# EAGLE schematic board (EAGLE 6.4)
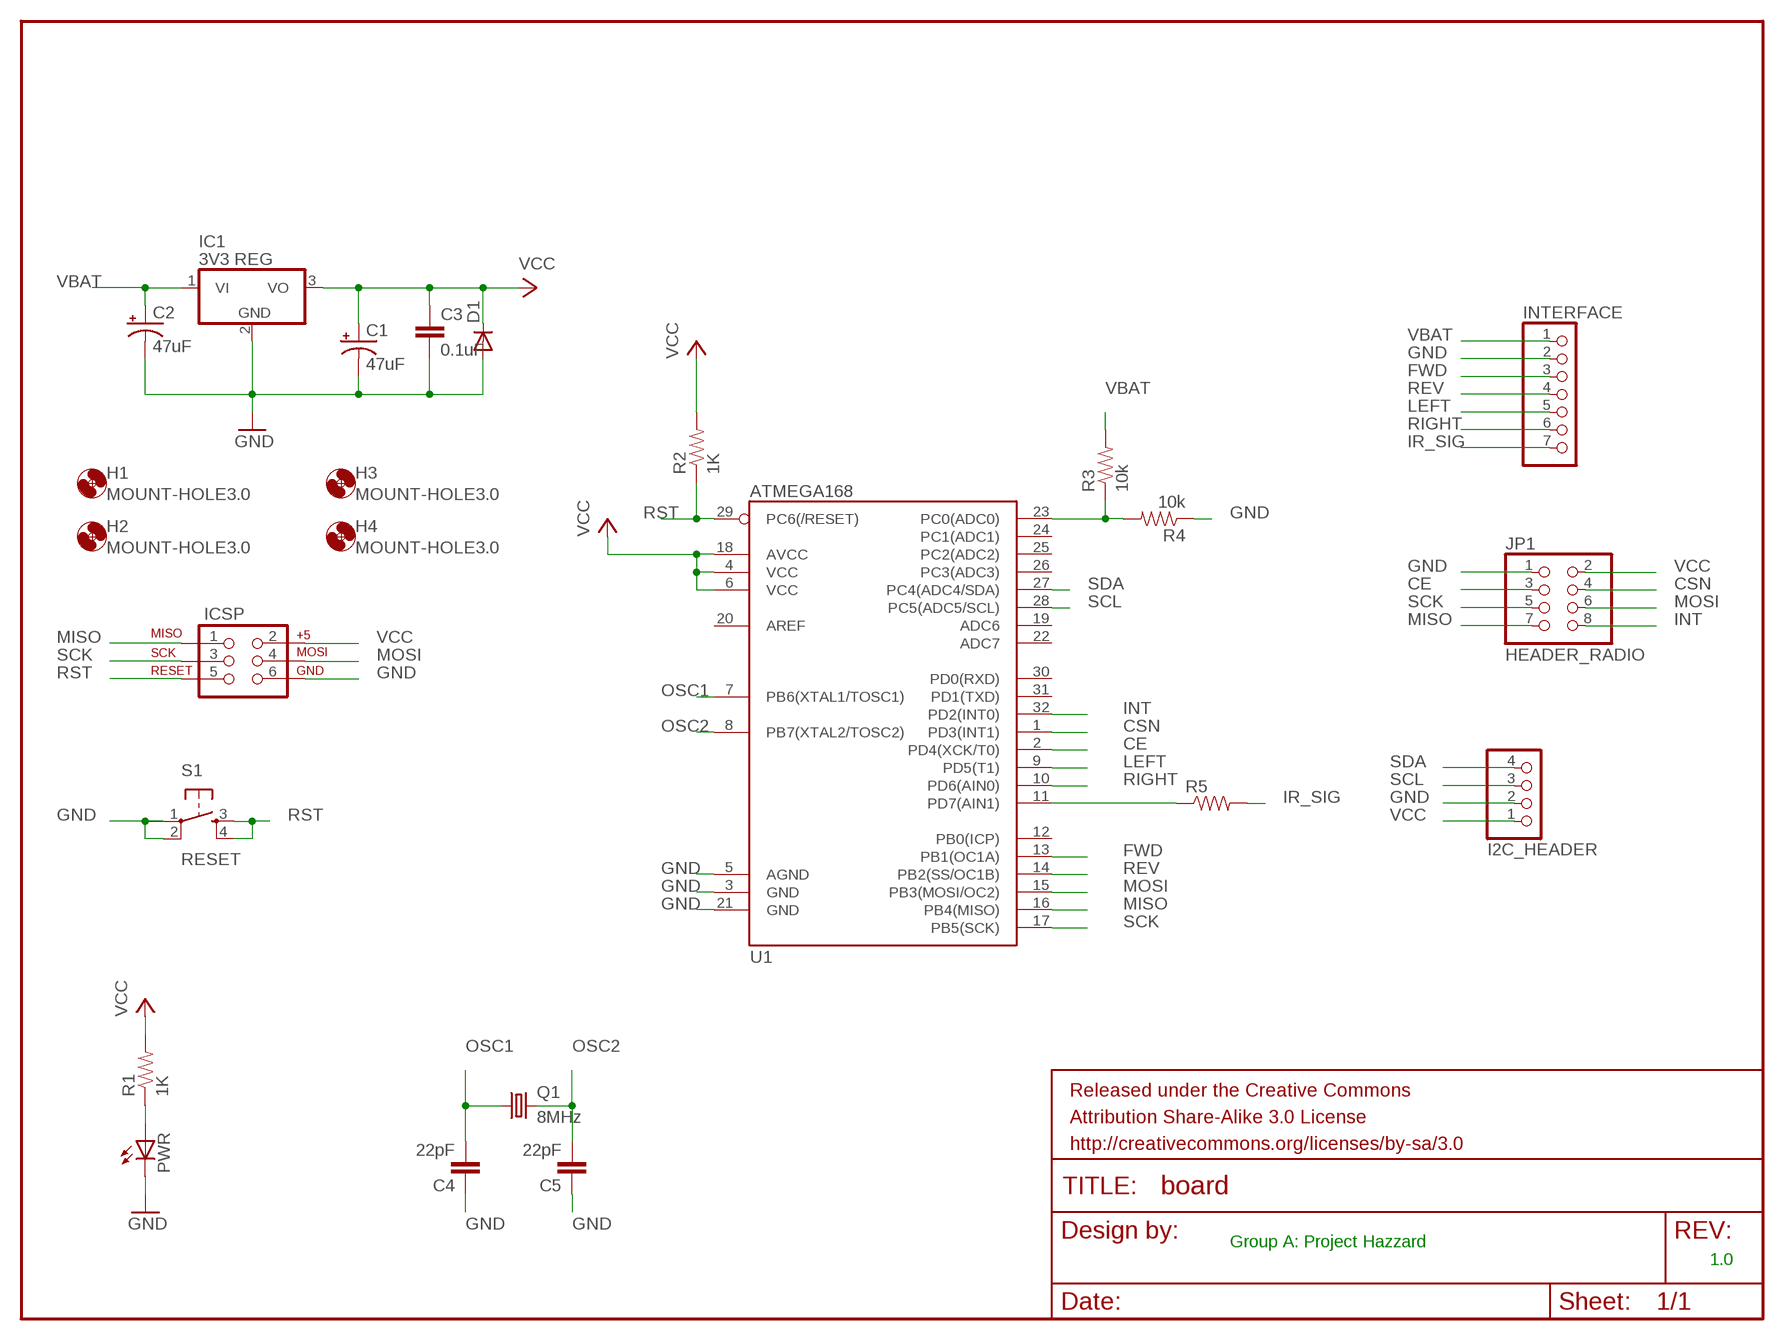
[diagram p0: schematic, sheet 1]

## Parts
C1  47uF  CAP_POLPTH1  [CPOL-RADIAL-100UF-25V]
C2  47uF  CAP_POLPTH1  [CPOL-RADIAL-100UF-25V]
C3  0.1uF  CAPKIT  [CAP-PTH-SMALL-KIT]
C4  22pF  CAPPTH  [CAP-PTH-SMALL]
C5  22pF  CAPPTH  [CAP-PTH-SMALL]
D1  DIODEPTH  [DIODE-1N4001]
FRAME1  FRAME-LETTER  [CREATIVE_COMMONS]
H1  MOUNT-HOLE3.0  [3,0]
H2  MOUNT-HOLE3.0  [3,0]
H3  MOUNT-HOLE3.0  [3,0]
H4  MOUNT-HOLE3.0  [3,0]
I2C_HEADER  PINHD-1X4  [1X04]
IC1  3V3 REG  786TV  [TO220V]
ICSP  AVR_SPI_PRG_6PTH  [2X3]
INTERFACE  PINHD-1X7  [1X07]
JP1  HEADER_RADIO  PINHD-2X4  [2X04]
PWR  LED5MM  [LED5MM]
Q1  8MHz  CRYSTALHC49S  [HC49/S]
R1  1K  RESISTORPTH-1/4W  [AXIAL-0.4]
R2  1K  RESISTORPTH-1/4W  [AXIAL-0.4]
R3  10k  RESISTORPTH-1/4W  [AXIAL-0.4]
R4  10k  RESISTORPTH-1/4W  [AXIAL-0.4]
R5  RESISTORPTH-1/4W  [AXIAL-0.4]
S1  RESET  TAC_SWITCHPTH  [TACTILE-PTH]
U1  ATMEGA168  [TQFP32-08]

## Nets
CE: JP1.3 U1.2(PD4(XCK/T0))
CSN: JP1.4 U1.1(PD3(INT1))
FWD: INTERFACE.3 U1.13(PB1(OC1A))
GND: C1.2(-) C2.2(-) C3.2 C4.1 C5.1 D1.A I2C_HEADER.2 IC1.2(GND) ICSP.6 INTERFACE.2 JP1.1 PWR.K(C) R4.P$1 S1.1 S1.2 U1.3(GND) U1.5(AGND) U1.21(GND)
INT: JP1.8 U1.32(PD2(INT0))
IR_SIG: INTERFACE.7 R5.P$2
LEFT: INTERFACE.5 U1.9(PD5(T1))
MISO: ICSP.1 JP1.7 U1.16(PB4(MISO))
MOSI: ICSP.4 JP1.6 U1.15(PB3(MOSI/OC2))
N$1: PWR.A R1.P$1
N$2: R3.P$1 R4.P$2 U1.23(PC0(ADC0))
N$3: R5.P$1 U1.11(PD7(AIN1))
OSC1: C4.2 Q1.1 U1.7(PB6(XTAL1/TOSC1))
OSC2: C5.2 Q1.2 U1.8(PB7(XTAL2/TOSC2))
REV: INTERFACE.4 U1.14(PB2(SS/OC1B))
RIGHT: INTERFACE.6 U1.10(PD6(AIN0))
RST: ICSP.5 R2.P$1 S1.3 S1.4 U1.29(PC6(/RESET))
SCK: ICSP.3 JP1.5 U1.17(PB5(SCK))
SCL: I2C_HEADER.3 U1.28(PC5(ADC5/SCL))
SDA: I2C_HEADER.4 U1.27(PC4(ADC4/SDA))
VBAT: C2.1(+) IC1.1(VI) INTERFACE.1 R3.P$2
VCC [power]: C1.1(+) C3.1 D1.C I2C_HEADER.1 IC1.3(VO) ICSP.2 JP1.2 R1.P$2 R2.P$2 U1.4(VCC) U1.6(VCC) U1.18(AVCC)
Unconnected: U1.12(PB0(ICP)) U1.19(ADC6) U1.20(AREF) U1.22(ADC7) U1.24(PC1(ADC1)) U1.25(PC2(ADC2)) U1.26(PC3(ADC3)) U1.30(PD0(RXD)) U1.31(PD1(TXD))

## Notes on the sheet
- Group A: Project Hazzard
- 1.0

## Library data of the parts
C1 C2 = SparkFun:CAP_POL: Capacitor Polarized These are standard SMD and PTH capacitors. Normally 10uF, 47uF, and 100uF in electrolytic and tantalum varieties. Always verify the external diameter of the through hole cap, it varies with capacity, voltage, and manufacturer. The EIA devices should be standard.
C3-C5 = SparkFun:CAP: Capacitor Standard 0603 ceramic capacitor, and 0.1" leaded capacitor.
D1 = SparkFun:DIODE: Diode These are standard reverse protection diodes and small signal diodes. SMA package can handle up to about 1A. SOD-323 can handle about 200mA. What the SOD-323 package when ordering, there are some mfgs out there that are 5-pin packages.
FRAME1 = SparkFun-Aesthetics:FRAME-LETTER: Schematic Frame Standard 8.5x11 US Letter frame
H1-H4 = holes:MOUNT-HOLE: MOUNTING HOLE with drill center marker
I2C_HEADER = pinhead:PINHD-1X4: PIN HEADER
IC1 = linear:78*: Positive VOLTAGE REGULATOR Source: http://cache.national.com/ds/LM/LM78L05.pdf http://www.fairchildsemi.com/ds/LM/LM7805.pdf
ICSP = SparkFun-Connectors:AVR_SPI_PRG_6: AVR ISP 6 Pin This is the reduced ISP connector for AVR programming. Common on Arduino. This footprint will take up less PCB space and can be used with a 10-pin to 6-pin adapter such as SKU: BOB-08508
INTERFACE = pinhead:PINHD-1X7: PIN HEADER
JP1 = pinhead:PINHD-2X4: PIN HEADER
PWR = SparkFun:LED: LEDs Standard schematic elements and footprints for 5mm, 3mm, 1206, and 0603 sized LEDs. 5mm - Spark Fun Electronics SKU : COM-00529 (and others)
Q1 = crystal:CRYSTAL: CRYSTAL; OC_FARNELL: 1667008; OC_NEWARK: unknown
R1 R2 = SparkFun:RESISTOR: Resistor Basic schematic elements and footprints for 0603, 1206, and PTH resistors.
R3-R5 = SparkFun-Passives:RESISTOR: Resistor Basic schematic elements and footprints for 0603, 1206, and PTH resistors.
S1 = SparkFun-Electromechanical:TAC_SWITCH: Momentary Switch Button commonly used for reset or general input. Spark Fun Electronics SKU : COM-00097 SMT- SWCH-08247
U1 = SparkFun:ATMEGA168

## Net classes
1 power: width 0.508 mm, clearance 0.152 mm